# Altium schematic sheet InterfaceConfiguracao.SchDoc: CONTROLADORA MAIS PIPOCA - REVISÃO EMC
size A3; DocumentNumber: GA0078; SheetNumber: 10; SheetTotal: 17
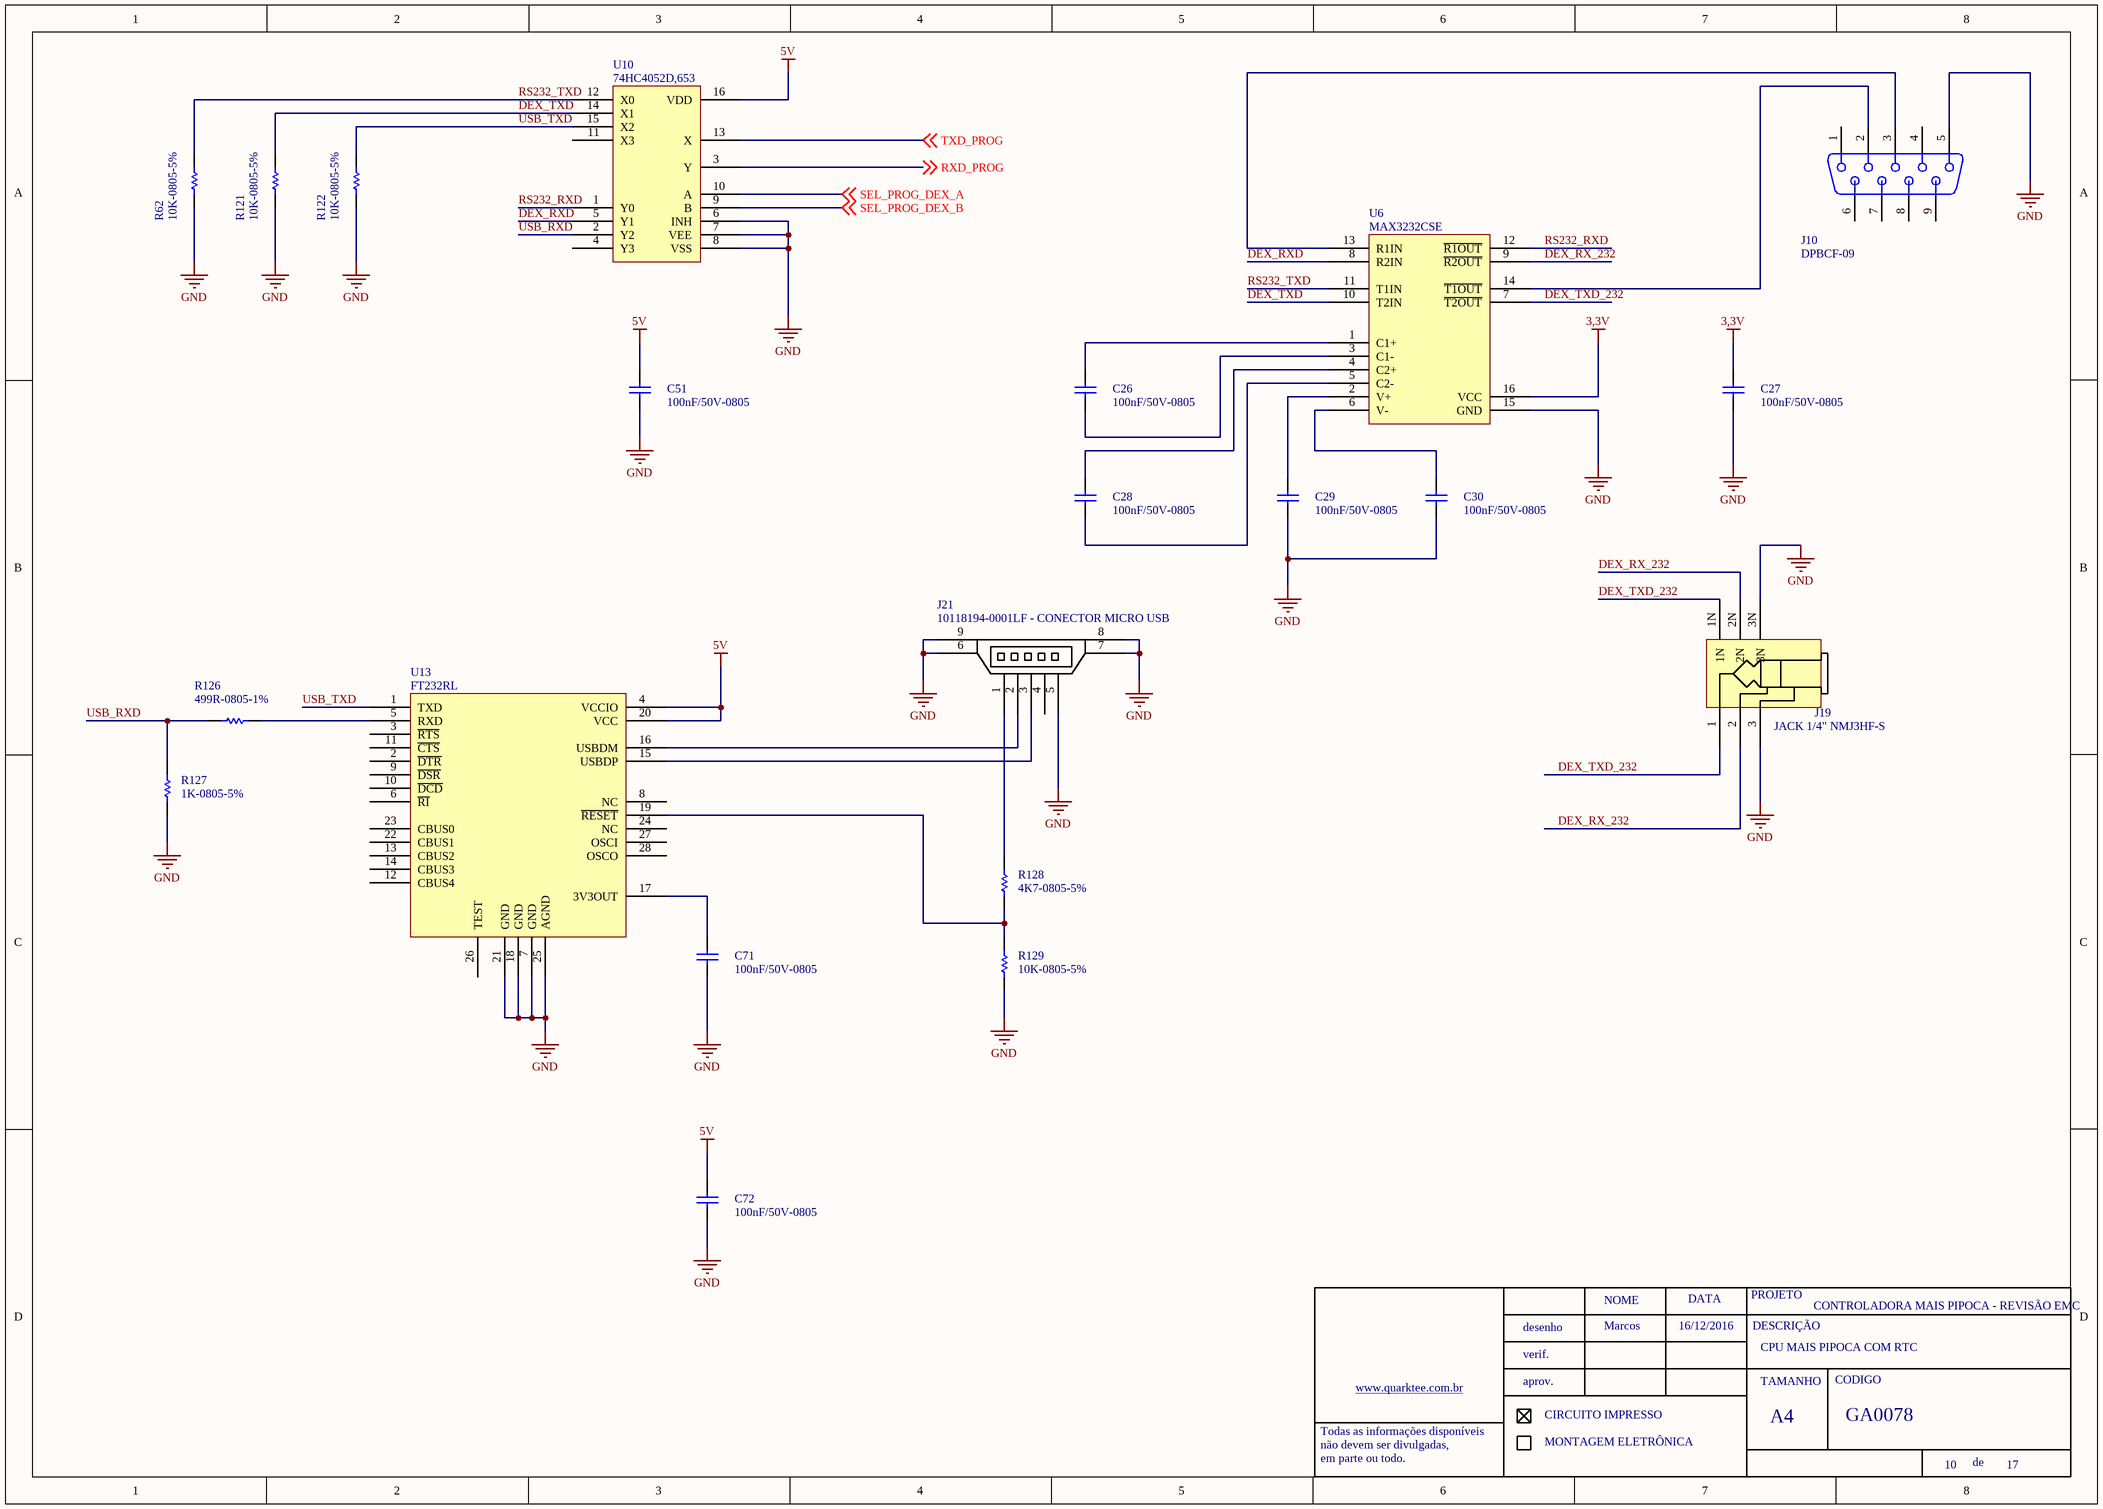
[diagram p0: InterfaceConfiguracao.SchDoc]

## Parts
C26  100nF/50V-0805  [0805-REVISADO ONDA]
C27  100nF/50V-0805  [0805-REVISADO ONDA]
C28  100nF/50V-0805  [0805-REVISADO ONDA]
C29  100nF/50V-0805  [0805-REVISADO ONDA]
C30  100nF/50V-0805  [0805-REVISADO ONDA]
C51  100nF/50V-0805  [0805-REVISADO ONDA]
C71  100nF/50V-0805  [0805-REVISADO ONDA]
C72  100nF/50V-0805  [0805-REVISADO ONDA]
J10  DPBCF-09  [DB9-FÊMEA MONTAGEM EM PCI 180]
J19  JACK 1/4" NMJ3HF-S
J21  10118194-0001LF - CONECTOR MICRO USB
R62  10K-0805-5%  [0805-REVISADO ONDA]
R121  10K-0805-5%  [0805-REVISADO ONDA]
R122  10K-0805-5%  [0805-REVISADO ONDA]
R126  499R-0805-1%  [0805-REVISADO ONDA]
R127  1K-0805-5%  [0805-REVISADO ONDA]
R128  4K7-0805-5%  [0805-REVISADO ONDA]
R129  10K-0805-5%  [0805-REVISADO ONDA]
U6  MAX3232CSE  [SOIC 16 PINOS]
U10  74HC4052D,653
U13  FT232RL

## Nets
3,3V: C27.2 U6.16(VCC)
5V: C51.2 C72.2 U10.16(VDD) U13.4(VCCIO) U13.20(VCC)
GND: C27.1 C29.1 C30.1 C51.1 C71.1 C72.1 J10.5 J19.3 J19.3N J21.5 J21.6 J21.7 J21.8 J21.9 R62.1 R121.1 R122.1 R127.1 R129.1 U6.15(GND) U10.6(INH) U10.7(VEE) U10.8(VSS) U13.7(GND) U13.18(GND) U13.21(GND) U13.25(AGND)
DEX_RX_232: J19.2 J19.2N U6.9(~{R2OUT})
DEX_RXD: U6.8(R2IN) U10.5(Y1)
DEX_TXD: R121.2 U6.10(T2IN) U10.14(X1)
DEX_TXD_232: J19.1 J19.1N U6.7(~{T2OUT})
RS232_RXD: U6.12(~{R1OUT}) U10.1(Y0)
RS232_TXD: R62.2 U6.11(T1IN) U10.12(X0)
RXD_PROG: U10.3(Y) ; off-sheet RXD_PROG
SEL_PROG_DEX_A: U10.10(A) ; off-sheet SEL_PROG_DEX_A
SEL_PROG_DEX_B: U10.9(B) ; off-sheet SEL_PROG_DEX_B
TXD_PROG: U10.13(X) ; off-sheet TXD_PROG
USB_RXD: R126.1 R127.2 U10.2(Y2)
USB_TXD: R122.2 U10.15(X2) U13.1(TXD)
NetC26_1: C26.1 U6.3(C1-)
NetC26_2: C26.2 U6.1(C1+)
NetC28_1: C28.1 U6.5(C2-)
NetC28_2: C28.2 U6.4(C2+)
NetC29_2: C29.2 U6.2(V+)
NetC30_2: C30.2 U6.6(V-)
NetC71_2: C71.2 U13.17(3V3OUT)
NetJ10_2: J10.2 U6.14(~{T1OUT})
NetJ10_3: J10.3 U6.13(R1IN)
NetJ21_1: J21.1 R128.2
NetJ21_2: J21.2 U13.16(USBDM)
NetJ21_3: J21.3 U13.15(USBDP)
NetR126_2: R126.2 U13.5(RXD)
NetR128_1: R128.1 R129.2 U13.19(~{RESET})

Not connected (* = marked no-connect by the designer): J10 1 4 6 7 8 9; J21 4; U10 4(Y3) 11(X3); U13 2(~{DTR}) 3(~{RTS}) 6(~{RI}) 8(NC) 9(~{DSR}) 10(~{DCD}) 11(~{CTS}) 12(CBUS4) 13(CBUS2) 14(CBUS3) 22(CBUS1) 23(CBUS0) 24(NC) 26(TEST) 27(OSCI) 28(OSCO)

## Notes on the sheet
- Marcos
- 16/12/2016
- CPU MAIS PIPOCA COM RTC
- NOME
- DATA
- PROJETO
- DESCRIÇÃO
- www.quarktee.com.br
- desenho
- verif.
- aprov.
- TAMANHO
- CODIGO
- Todas as informações disponíveis
- não devem ser divulgadas,
- em parte ou todo.
- CIRCUITO IMPRESSO
- MONTAGEM ELETRÔNICA
- A4
- de

## Library data of the parts
C26-C30 C51 C71 C72 = 100nF/50-0805-NPO: ERP: 104.11.005
J10 = DB-9 - FÊMEA 180º MONTAGEM EM PCI: DBPCF-09; ERP: 434.00.002
J19 = NMJ3HF-S
J21 = MINI_USB
R126 = 1K-0805-5%: ERP: 102.11.042
R128 = 10K-0805-5%: ERP: 102.11.054
U10 = CD74HC4052PWR
R62 R121 R122 R129 = 10K-0805-5%: ERP: 102.11.054
R127 = 1K-0805-5%: ERP: 102.11.042
U6 = MAX3232CSE: ERP: 110.02.001